# EAGLE design ExpansionBoard (EAGLE 9.5.2)
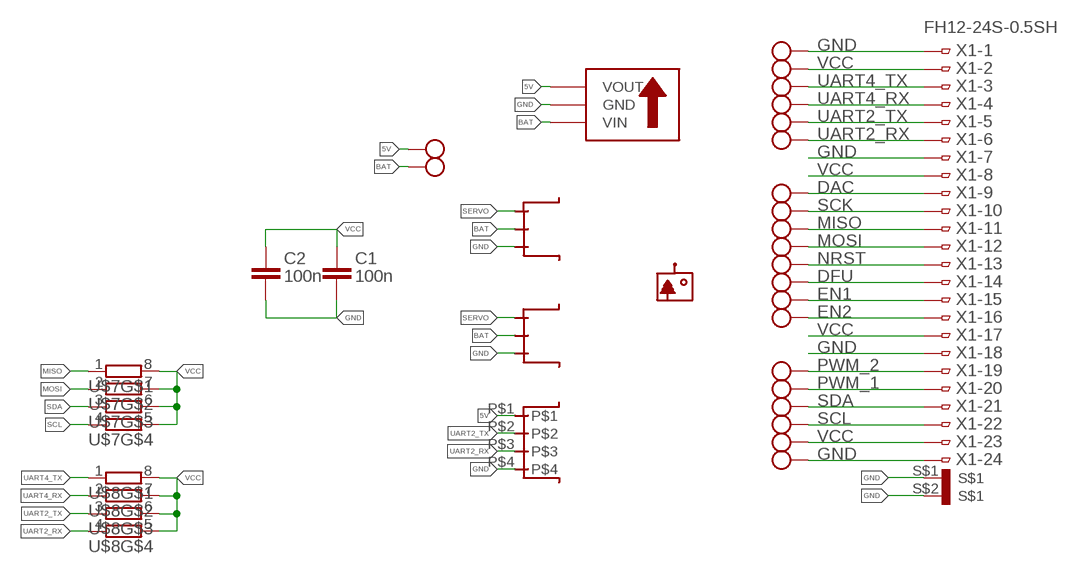
[diagram p0: schematic, sheet 1]

## Parts
C1  100n  CAPACITOR0603  [C0603]
C2  100n  CAPACITOR0603  [C0603]
U$1  THT_PADSQ  [THT_PAD_SQ]
U$2  THT_PAD  [THT_PAD]
U$3  THT_PAD  [THT_PAD]
U$4  THT_PAD  [THT_PAD]
U$5  THT_PAD  [THT_PAD]
U$6  THT_PAD  [THT_PAD]
U$7  RESISTORARRAY  [0603-ARC]
U$8  RESISTORARRAY  [0603-ARC]
U$9  THT_PAD  [THT_PAD]
U$10  THT_PAD  [THT_PAD]
U$11  THT_PAD  [THT_PAD]
U$12  THT_PAD  [THT_PAD]
U$13  THT_PAD  [THT_PAD]
U$14  THT_PAD  [THT_PAD]
U$15  THT_PAD  [THT_PAD]
U$16  THT_PAD  [THT_PAD]
U$17  LOGOSQSM  [LOGOSQSM]
U$19  THT_PAD  [THT_PAD]
U$20  THT_PAD  [THT_PAD]
U$21  THT_PAD  [THT_PAD]
U$22  THT_PAD  [THT_PAD]
U$23  THT_PADSQ  [THT_PAD_SQ]
U$24  THT_PAD  [THT_PAD]
U$25  MODULE_STEPUP  [MODULE_STEPUP]
U$26  CONNECTOR_F_X4_JST_SMD  [4X_JSTSMD_F]
U$27  THT_PAD  [THT_PAD]
U$28  CONNECTOR_F_X3_JST_SMD  [3X_JSTSMD_F]
U$29  CONNECTOR_F_X3_JST_SMD  [3X_JSTSMD_F]
U$30  THT_PAD  [THT_PAD]
X1  FH12-24S-0.5SH  [FH12-24S-0.5SH]

## Nets
5V: U$25.VOUT U$26.P$1 U$27.P$1
BAT: U$25.VIN U$28.P$2 U$29.P$2 U$30.P$1
DAC: U$9.P$1 X1.9
DFU: U$14.P$1 X1.14
EN1: U$15.P$1 X1.15
EN2: U$16.P$1 X1.16
GND: C1.2 C2.2 U$1.P$1 U$23.P$1 U$25.GND U$26.P$4 U$28.P$3 U$29.P$3 X1.1 X1.7 X1.18 X1.24 X1.S$1 X1.S$2
MISO: U$7.1 U$11.P$1 X1.11
MOSI: U$7.2 U$12.P$1 X1.12
NRST: U$13.P$1 X1.13
PWM_1: U$20.P$1 X1.20
PWM_2: U$19.P$1 X1.19
SCK: U$10.P$1 X1.10
SCL: U$7.4 U$22.P$1 X1.22
SDA: U$7.3 U$21.P$1 X1.21
SERVO: U$28.P$1 U$29.P$1
UART2_RX: U$6.P$1 U$8.4 U$26.P$3 X1.6
UART2_TX: U$5.P$1 U$8.3 U$26.P$2 X1.5
UART4_RX: U$4.P$1 U$8.2 X1.4
UART4_TX: U$3.P$1 U$8.1 X1.3
VCC: C1.1 C2.1 U$2.P$1 U$7.5 U$7.6 U$7.7 U$7.8 U$8.5 U$8.6 U$8.7 U$8.8 U$24.P$1 X1.2 X1.8 X1.17 X1.23
Unconnected: U$28.S$1 U$28.S$2(S$1) U$29.S$1 U$29.S$2(S$1)

## Library data of the parts
C1 C2 = Unified:CAPACITOR
U$1-U$6 U$9-U$16 U$19-U$24 U$27 U$30 = SobieskiSat2:THT_PAD
U$7 U$8 = SobieskiSat2:RESISTORARRAY
U$17 = SobieskiSat2:LOGO
U$25 = SobieskiSat2:MODULE_STEPUP
U$26 = Unified:CONNECTOR_F_X4
U$28 U$29 = Unified:CONNECTOR_F_X3
X1 = SobieskiSat2:FH12-24S-0.5S: 0.5mm Pitch Connectors For FPC/FFC Source: Data sheet <http://www.hirose.co.jp/cataloge_hp/e58605370.pdf>; MPN: FH12-24S-0.5SH(55); OC_FARNELL: 1324552; OC_NEWARK: 34M6170

## Board
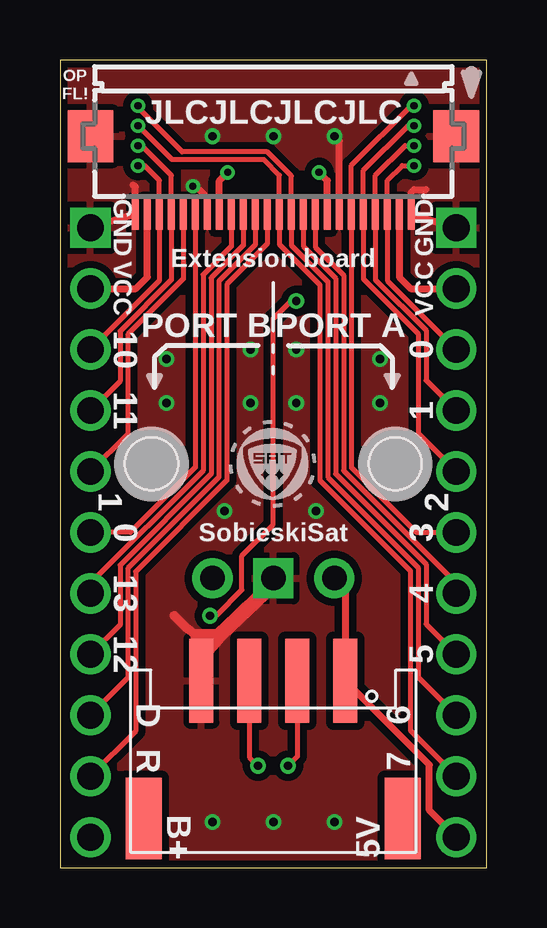
[diagram p1: board, top side]
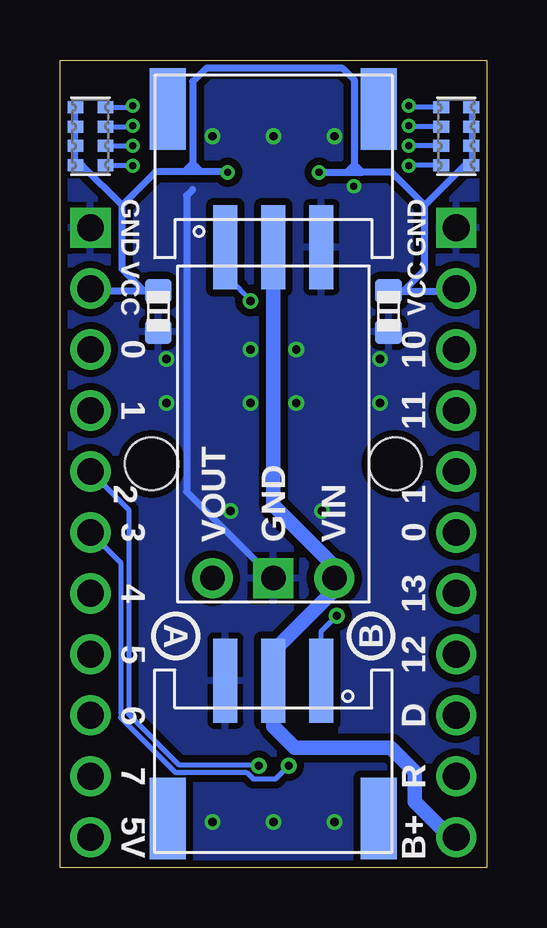
[diagram p2: board, bottom side, seen from below]

Size 17.78 x 33.66 mm. Coordinates in mm from the lower left corner, seen from the top.
Outline: 0,0 17.78,0 17.78,33.66 0,33.66 0,0
Copper layers (1*16): Top 0.035mm / dielectric 1.2mm / Bottom 0.035mm
Design rules "jlcpcb_2layers": minimum track width 5mil, minimum drill 0.3mm, track to track 5mil, track to pad 5mil, pad to pad 5mil, via to via 5mil, smd to smd 5mil, copper to edge 0.2mm, drill to drill 6mil, minimum pad ring 3mil, minimum via ring 0.15mm, stop-mask expansion 4mil, vias tented up to drill 0.35mm, thermal gap 10mil
Holes 2.2 mm at 3.81,16.83 13.97,16.83

### Footprints (pad centres in the part's own frame; a part is rotated, then mirrored left to right if it is on the bottom)
C0603 = smd 1 x 1.1: 1 -0.85,0; 2 0.85,0
THT_PAD_SQ = drill 1.118 pad 1.676 square: P$1 0,0
THT_PAD = drill 1.118 pad 1.676: P$1 0,0
0603-ARC = smd 0.5 x 0.65: 1 -1.2,-0.625; 2 -0.4,-0.625; 3 0.4,-0.625; 4 1.2,-0.625; 5 1.2,0.625; 6 0.4,0.625; 7 -0.4,0.625; 8 -1.2,0.625
MODULE_STEPUP = drill 1.016 pad 1.676 square: GND 0,0 | drill 1.016 pad 1.676: VIN -2.54,0; VOUT 2.54,0
4X_JSTSMD_F = smd 1 x 3.5: P$1 -3,-3.35; P$2 -1,-3.35; P$3 1,-3.35; P$4 3,-3.35 | smd 1.5 x 3.4: S$1 -5.4,2.4; S$2 5.4,2.4
3X_JSTSMD_F = smd 1 x 3.5: P$1 -2,-3.35; P$2 0,-3.35; P$3 2,-3.35 | smd 1.5 x 3.4: S$1 -4.4,2.4; S$2 4.4,2.4
FH12-24S-0.5SH = smd 0.3 x 1.3: 1 -5.75,3.25; 2 -5.25,3.25; 3 -4.75,3.25; 4 -4.25,3.25; 5 -3.75,3.25; 6 -3.25,3.25; 7 -2.75,3.25; 8 -2.25,3.25; 9 -1.75,3.25; 10 -1.25,3.25; 11 -0.75,3.25; 12 -0.25,3.25; 13 0.25,3.25; 14 0.75,3.25; 15 1.25,3.25; 16 1.75,3.25; 17 2.25,3.25; 18 2.75,3.25; 19 3.25,3.25; 20 3.75,3.25; 21 4.25,3.25; 22 4.75,3.25; 23 5.25,3.25; 24 5.75,3.25 | smd 1.905 x 2.159: S$1 -7.62,0; S$2 7.62,0

### Placement (x,y rotation side)
C1  4.09,23.18 270 bottom
C2  13.69,23.18 270 bottom
U$1  16.51,26.67 270 top
U$2  16.51,24.13 270 top
U$3  16.51,21.59 270 top
U$4  16.51,19.05 270 top
U$5  16.51,16.51 270 top
U$6  16.51,13.97 270 top
U$7  1.27,30.48 270 bottom
U$8  16.51,30.48 90 bottom
U$9  16.51,11.43 0 top
U$10  16.51,8.89 90 top
U$11  16.51,6.35 90 top
U$12  16.51,3.81 90 top
U$13  1.27,3.81 0 top
U$14  1.27,6.35 90 top
U$15  1.27,8.89 90 top
U$16  1.27,11.43 90 top
U$17  6.86,14.83 0 top
U$19  1.27,13.97 90 top
U$20  1.27,16.51 90 top
U$21  1.27,19.05 90 top
U$22  1.27,21.59 90 top
U$23  1.27,26.67 90 top
U$24  1.27,24.13 90 top
U$25  8.89,12.06 180 bottom
U$26  8.89,4.45 180 top
U$27  16.51,1.27 0 top
U$28  8.89,4.45 180 bottom
U$29  8.89,29.21 0 bottom
U$30  1.27,1.27 0 top
X1  8.89,30.48 180 top

### Tracks (layer width: path | path; a pad name or v marks a point on that pad's centre or on a via)
5V
  Top 0.3: U$27.P$1 15.39,2.38 15.39,4.29 U$26.P$1 11.89,11.61 U$25.VOUT
BAT
  Bottom 0.6: U$29.P$2 8.89,15.11 6.35,12.56 U$25.VIN 6.35,11.56 8.89,9.03 U$28.P$2 8.89,5.89 8,5 4,5 3,4 3,2.75 1.52,1.27 U$30.P$1
DAC
  Top 0.2: X1.9 10.64,25.86 11.81,24.69 11.81,16.54 16.51,11.85 U$9.P$1
DFU
  Top 0.2: X1.14 8.14,25.96 6.62,24.45 6.62,16.27 2.83,12.48 2.83,7.91 U$14.P$1
EN1
  Top 0.2: X1.15 7.64,25.93 6.29,24.58 6.29,16.41 2.5,12.61 2.5,10.12 U$15.P$1
EN2
  Top 0.2: X1.16 7.14,25.89 5.97,24.72 5.97,16.54 1.27,11.85 U$16.P$1
GND  (via drill 0.3, 0.35)
  Top 0.3: 15.25,28.25 14.75,28.25 14.64,28.14 X1.1 U$1.P$1 | X1.7 11.64,30.27 v11.43,30.48 | 5.89,8.81 U$26.P$4 5.89,9.36 | v5.54,28.4 5.67,28.4 6.14,27.92 X1.18 | U$23.P$1 X1.24 3.14,28.36 3.05,28.45
  Top 0.4: 5.89,9.36 5.66,9.7 5.25,10 4.75,10.5
  Top 0.5: 5.66,9.7 6.66,9.7
  Top 0.6: U$25.GND 8.89,11.81 6.66,9.7 5.89,8.81
  Bottom 0.3: 12.25,28.25 12.5,28 12.5,15.68 U$25.GND
  other vias: 6.35,1.91 8.89,1.91 11.43,1.91 6.86,14.86 10.67,14.86 7.94,19.37 9.84,19.37 7.94,21.59 9.84,21.59 13.34,21.19 13.34,19.37 4.45,21.19 4.45,19.37 6.35,30.48 8.89,30.48
  pour Bottom (isolate 0.305): -0.75,34.75 18.64,34.75 18.64,-0.25 -0.5,-0.25 -1,0.25 -1,34.5
  pour Top (isolate 0.305): -1.5,35.25 17.25,35.25 18.25,34.25 18.25,0.25 17.5,-0.5 -0.5,-0.5 -1.75,0.75 -1.75,35
MISO  (via drill 0.3)
  Top 0.2: U$11.P$1 14.92,7.94 14.92,12.51 11.16,16.27 11.16,24.42 9.64,25.93 X1.11 9.64,28.82 8.63,29.83 5.08,29.83 3.25,31.66 v3.25,31.75
  Bottom 0.2: U$7.1 3.18,31.68 v3.25,31.75
MOSI  (via drill 0.3)
  Top 0.2: U$12.P$1 14.6,5.72 14.6,12.37 10.83,16.14 10.83,24.28 9.14,25.97 X1.12 9.14,28.86 8.5,29.5 4.67,29.5 v3.25,30.92
  Bottom 0.2: U$7.2 3.21,30.88 v3.25,30.92
NRST
  Top 0.2: X1.13 8.64,26 6.95,24.31 6.95,16.14 3.15,12.34 3.15,5.69 U$13.P$1
PWM_1
  Top 0.2: X1.20 5.14,24.54 2.83,22.22 2.83,18.07 U$20.P$1
PWM_2
  Top 0.2: U$19.P$1 2.93,13.97 5.64,16.68 X1.19
SCK
  Top 0.2: X1.10 10.14,25.9 11.49,24.55 11.49,16.41 15.25,12.64 15.25,10.15 U$10.P$1
SCL  (via drill 0.3)
  Top 0.2: U$22.P$1 4.14,24.46 X1.22 4.14,28.64 3.53,29.25 v3.25,29.25
  Bottom 0.2: U$7.4 3.22,29.28 v3.25,29.25
SDA  (via drill 0.3)
  Top 0.2: U$21.P$1 2.5,20.28 2.5,22.36 4.64,24.5 X1.21 4.64,28.85 3.4,30.08 v3.25,30.08
  Bottom 0.2: U$7.3 v3.25,30.08
SERVO  (via drill 0.35)
  Top 0.2: v6.25,10.5 6.5,10.5 7.58,11.57 7.58,13 8.88,14.3 8.88,22.86 9.62,23.61 v9.84,23.61
  Bottom 0.2: U$28.P$1 6.89,9.86 v6.25,10.5 | v9.84,23.61 11,24.86 11,25.75 U$29.P$1
UART2_RX  (via drill 0.3, 0.35)
  Top 0.2: U$6.P$1 14.85,13.97 12.14,16.68 X1.6 12.14,29.26 14.63,31.75 v14.75,31.75 | U$26.P$3 7.89,4.61 v8.25,4.25
  Bottom 0.2: U$6.P$1 15.25,12.71 15.25,6.25 12.97,3.97 10,3.97 9.73,3.7 8.8,3.7 v8.25,4.25 | U$8.4 14.82,31.68 v14.75,31.75
UART2_TX  (via drill 0.3, 0.35)
  Top 0.2: U$5.P$1 14.92,18.1 14.92,22.25 12.64,24.54 X1.5 12.64,29.05 14.5,30.92 v14.75,30.92 | U$26.P$2 9.89,4.64 v9.5,4.25
  Bottom 0.2: U$5.P$1 14.92,14.92 14.92,6.38 12.84,4.3 9.55,4.3 v9.5,4.25 | U$8.3 14.79,30.88 v14.75,30.92
UART4_RX  (via drill 0.3)
  Top 0.2: U$4.P$1 15.25,20.31 15.25,22.39 13.14,24.5 X1.4 13.14,28.85 14.38,30.08 v14.75,30.08
  Bottom 0.2: U$8.2 v14.75,30.08
UART4_TX  (via drill 0.3)
  Top 0.2: U$3.P$1 13.64,24.46 X1.3 13.64,28.64 14.25,29.25 v14.75,29.25
  Bottom 0.2: U$8.1 14.78,29.28 v14.75,29.25
VCC  (via drill 0.3)
  Top 0.3: X1.2 14.14,24.61 14.62,24.13 U$2.P$1 | X1.23 3.64,24.61 3.16,24.13 U$24.P$1 | X1.17 6.64,28.63 v6.99,28.97 | X1.8 11.14,28.63 v10.79,28.97
  Bottom 0.2: U$7.8 U$7.7 U$7.6 U$7.5 0.91,29.28 | U$8.5 U$8.6 U$8.7 U$8.8 16.87,29.28
  Bottom 0.3: U$2.P$1 16.41,24.03 C2.1 14.28,24.03 15.2,24.95 15.2,27.6 | 2.58,27.6 0.91,29.28 | 2.58,27.6 2.58,24.91 3.47,24.03 C1.1 1.37,24.03 U$24.P$1 | 16.87,29.28 15.2,27.6 | 5.59,28.97 5.18,28.97 | 5.18,28.97 3.96,28.97 2.58,27.6 | 12.25,29 12.61,29 | 12.61,29 13.8,29 15.2,27.6 | 12.25,29.36 12.25,32.75 11.7,33.3 6,33.3 5.52,32.82 5.52,29.31 | 12.25,29.36 12.25,29 | v6.99,28.97 5.84,28.97 | 5.84,28.97 5.59,28.97 | v10.79,28.97 10.82,29 11.89,29 | 11.89,29 12.25,29 | 5.59,28.97 5.52,29.04 5.52,29.3 | 5.52,29.31 5.52,29.3 | 5.84,28.97 5.52,29.3 | 5.18,28.97 5.52,29.31 | 11.89,29 12.25,29.36 | 12.25,29.36 | 12.61,29 12.25,29.36

### Text on the board
tPlace: OP / FL! | JLCJLCJLCJLC | GND | GND | Extension board | VCC | VCC | 10 | PORT B | PORT A | 0 | 11 | 1 | 1 | 2 | 0 | SobieskiSat | 3 | 13 | 4 | 12 | 5 | D | 6 | R | 7 | B+ | 5V
bPlace: GND | GND | VCC | VCC | 10 | 0 | 11 | 1 | 1 | 2 | 0 | 3 | 13 | 4 | B | A | 12 | 5 | D | 6 | R | 7 | B+ | 5V